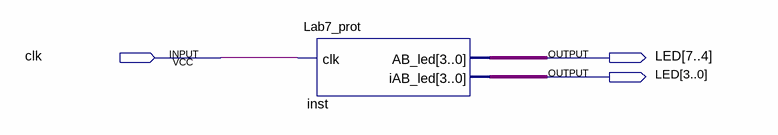
[diagram p0: schematic sheet]
// Quartus schematic Lab7_prot.bdf as structural Verilog: 1 symbols, 3 pins
module Lab7_prot (
  input  clk,
  output [7:0] LED
);

  Lab7_prot inst (.clk(clk), .AB_led(LED[7:4]), .iAB_led(LED[3:0]));
endmodule
